# EAGLE design esp8266-hw7.1 (EAGLE 9.5.2)
ESP8266 HW
CNAME: Sensorboard; CREVISION: HW8.2; DESIGNER: Pär Sundbäck

## Sheet 1 of 2
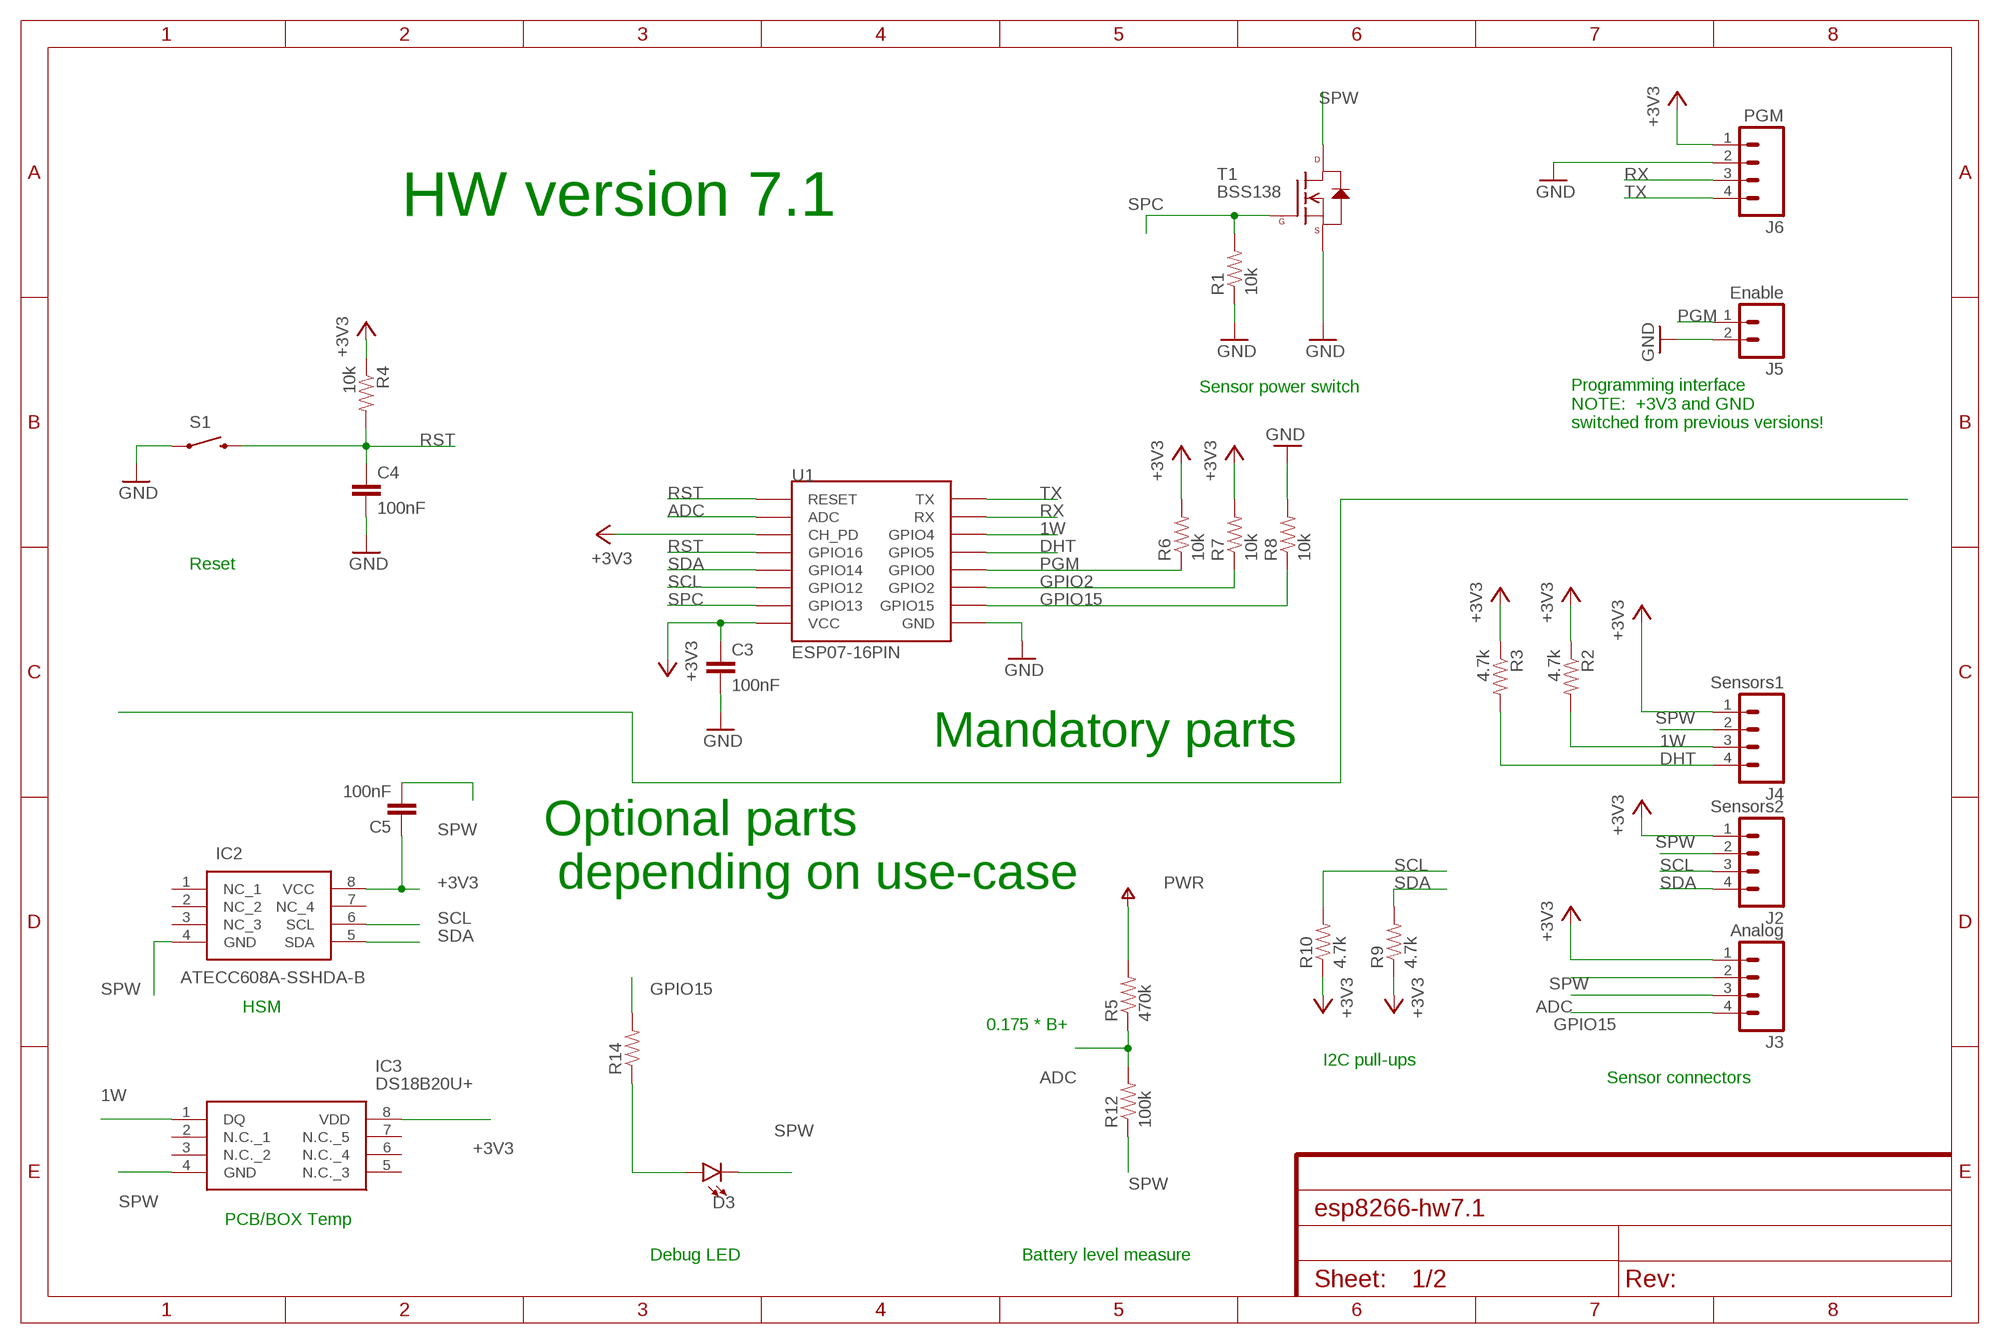
[diagram p0: schematic, sheet 1]

### Parts
C3  100nF  CAP0805  [0805]
C4  100nF  CAP0805  [0805]
C5  100nF  CAP0805  [0805]
D3  LED3MM  [LED_3MM]
IC2  ATECC608A-SSHDA-B  [SOIC127P600X175-8N]
IC3  DS18B20U+  [SOP65P490X110-8N]
J2  Sensors2  M04PTH  [1X04]
J3  Analog  M04PTH  [1X04]
J4  Sensors1  M04PTH  [1X04]
J5  Enable  M02PTH  [1X02]
J6  PGM  M04PTH  [1X04]
R1  10k  RESISTOR0805-RES  [0805]
R2  4.7k  RESISTOR0805-RES  [0805]
R3  4.7k  RESISTOR0805-RES  [0805]
R4  10k  RESISTOR0805-RES  [0805]
R5  470k  RESISTOR0805-RES  [0805]
R6  10k  RESISTOR0805-RES  [0805]
R7  10k  RESISTOR0805-RES  [0805]
R8  10k  RESISTOR0805-RES  [0805]
R9  4.7k  RESISTOR0805-RES  [0805]
R10  4.7k  RESISTOR0805-RES  [0805]
R12  100k  RESISTOR0805-RES  [0805]
R14  470  RESISTOR0805-RES  [0805]
S1  RESET  SWITCH-MOMENTARY-2SMD-1101NE  [TACTILE-SWITCH-1101NE]
T1  BSS138  N-CHANNEL-MOSFET-BSS138  [SOT23-3]
U1  ESP07-16PIN  [ESP07-16PIN]

### Nets
1W: IC3.1(DQ) J4.3 R2.2 U1.GPIO4
+3V3: C3.1 C5.1 IC2.8(VCC) IC3.8(VDD) J2.1 J3.1 J4.1 J6.1 R2.1 R3.1 R4.1 R6.2 R7.2 R9.1 R10.1 U1.CH_PD U1.VCC ; also sheet 2
ADC: J3.3 R5.1 R12.2 U1.ADC
DHT: J4.4 R3.2 U1.GPIO5
GND: C3.2 C4.2 J5.2 J6.2 R1.1 R8.2 S1.1 T1.2(S) U1.GND ; also sheet 2
GPIO2: R7.1 U1.GPIO2
GPIO15: J3.4 R8.1 R14.2 U1.GPIO15
N$8: D3.A R14.1
PGM: J5.1 R6.1 U1.GPIO0
PWR: R5.2 ; supply symbol labelled V+ ; also sheet 2
RST: C4.1 R4.2 S1.2 U1.GPIO16 U1.REST(RESET)
RX: J6.3 U1.RX
SCL: IC2.6(SCL) J2.3 R10.2 U1.GPIO12
SDA: IC2.5(SDA) J2.4 R9.2 U1.GPIO14
SPC: R1.2 T1.1(G) U1.GPIO13
SPW: C5.2 D3.K(C) IC2.4(GND) IC3.4(GND) J2.2 J3.2 J4.2 R12.1 T1.3(D)
TX: J6.4 U1.TX
Unconnected: IC2.1(NC_1) IC2.2(NC_2) IC2.3(NC_3) IC2.7(NC_4) IC3.2(N.C._1) IC3.3(N.C._2) IC3.5(N.C._3) IC3.6(N.C._4) IC3.7(N.C._5)

### Notes on the sheet
- HW version 7.1
- Sensor power switch
- Programming interface
  NOTE:  +3V3 and GND 
  switched from previous versions!
- Reset
- Mandatory parts
- Optional parts
   depending on use-case
- HSM
- 0.175 * B+
- I2C pull-ups
- Sensor connectors
- PCB/BOX Temp
- Debug LED | Battery level measure

## Sheet 2 of 2
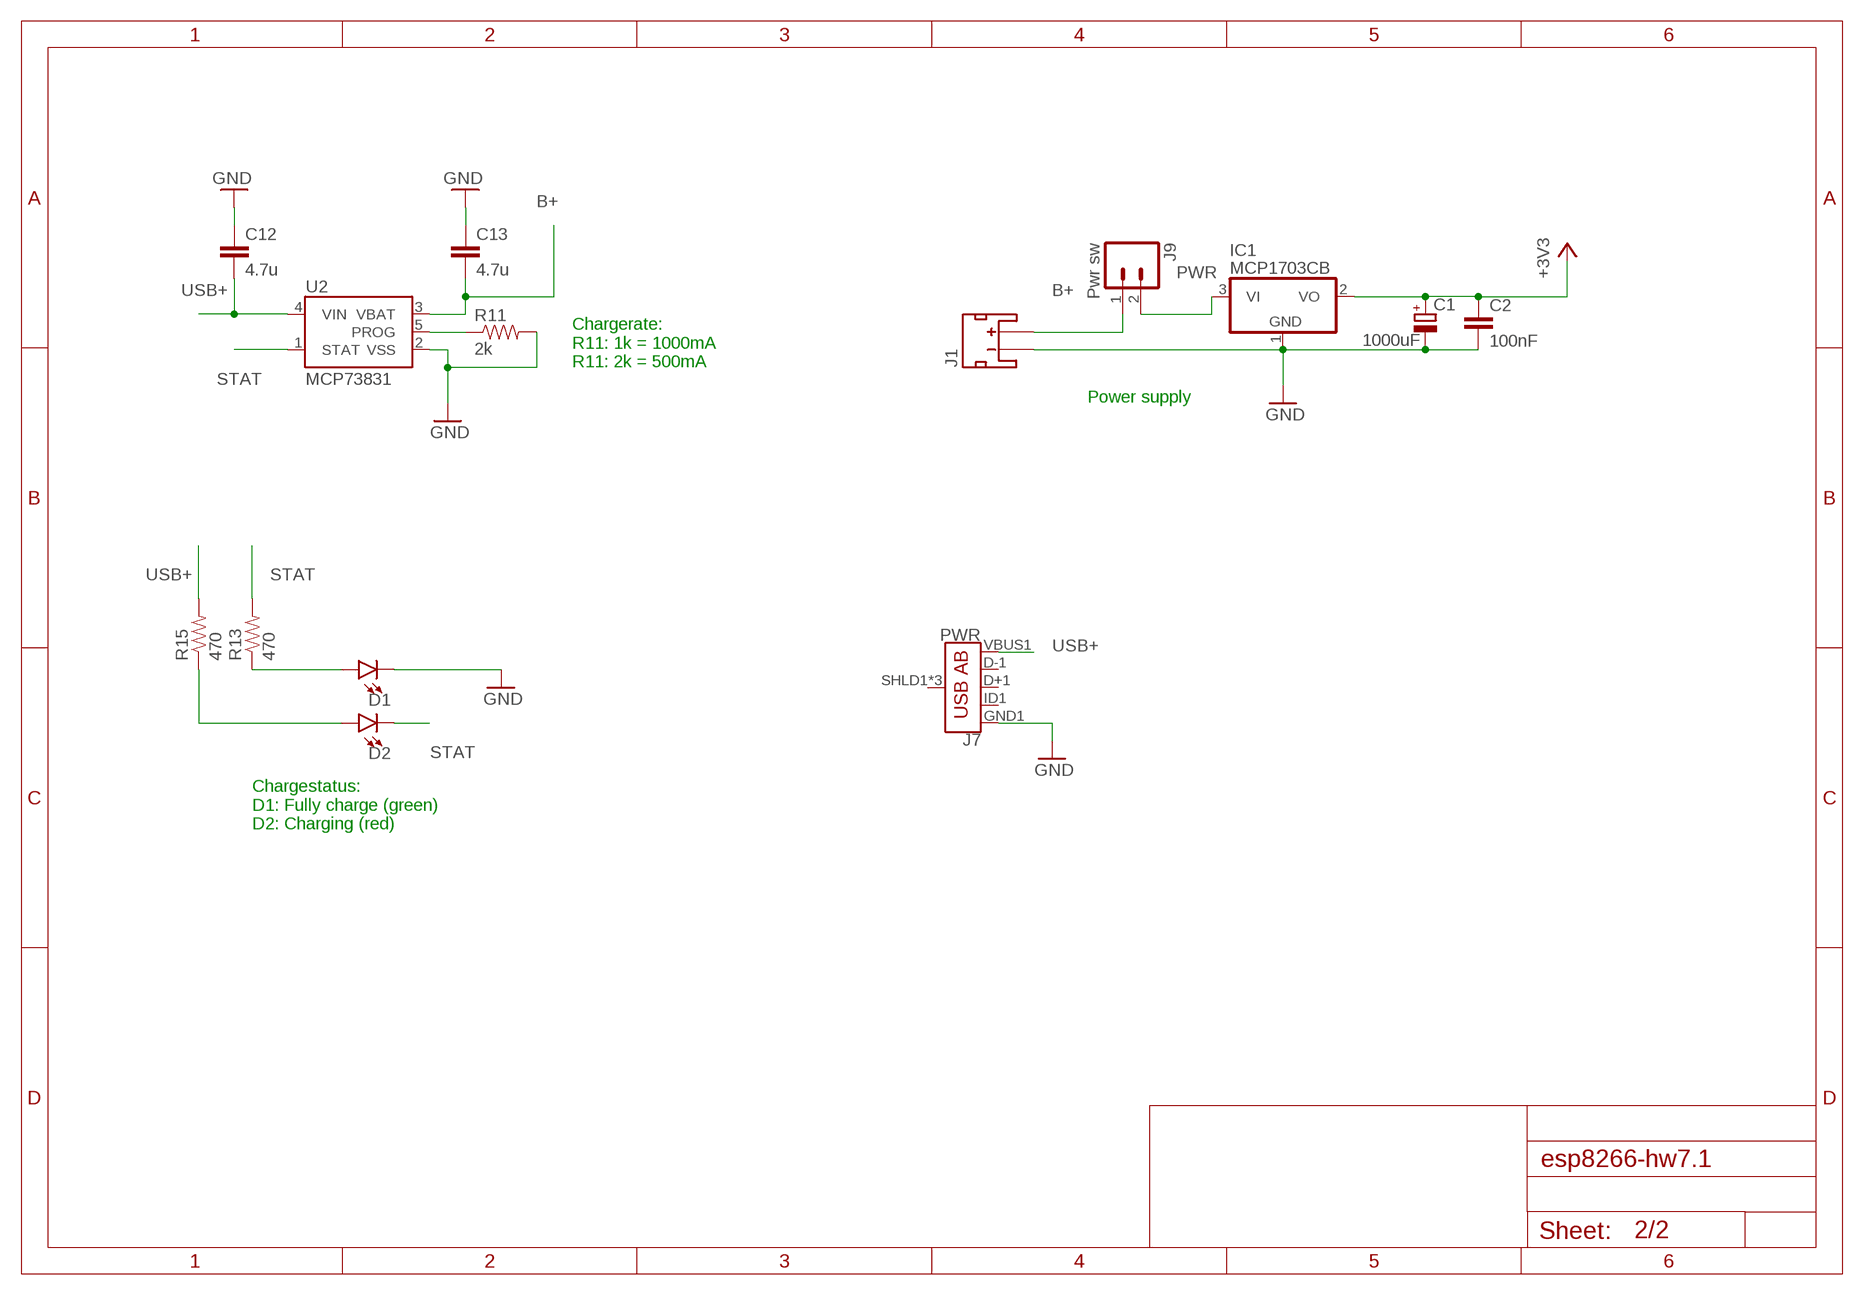
[diagram p1: schematic, sheet 2]

### Parts
C1  1000uF  CPOL-EUE3.5-8  [E3,5-8]
C2  100nF  CAP0805  [0805]
C12  4.7u  CAP0805  [0805]
C13  4.7u  CAP0805  [0805]
D1  LED3MM  [LED_3MM]
D2  LED3MM  [LED_3MM]
IC1  MCP1703CB  [SOT23]
J1  J1  JST_2MM_MALE  [JST-2-SMD]
J7  PWR  USB_AB_SMT  [USB-AB-MICRO-SMD]
J9  Pwr sw  M02PTH  [1X02]
R11  2k  RESISTOR0805-RES  [0805]
R13  470  RESISTOR0805-RES  [0805]
R15  470  RESISTOR0805-RES  [0805]
U2  MCP73831  [SOT23-5]

### Nets
+3V3: C1.+ C2.1 IC1.2(VO) ; also sheet 1
B+: C13.2 J1.2(+) J9.1 U2.3(VBAT)
GND: C1.- C2.2 C12.1 C13.1 D1.K(C) IC1.1(GND) J1.1(-) J7.GND1(GND) R11.2 U2.2(VSS) ; also sheet 1
N$2: D1.A R13.1
N$3: D2.A R15.1
N$10: R11.1 U2.5(PROG)
PWR: IC1.3(VI) J9.2 ; also sheet 1
STAT: D2.K(C) R13.2 U2.1(STAT)
USB+: C12.2 J7.VBUS1(VBUS) R15.2 U2.4(VIN)
Unconnected: J1.NC1(PAD1) J1.NC2(PAD2) J7.D+1(D+) J7.D-1(D-) J7.ID1(USBID) J7.SHLD1(SHIELD) J7.SHLD2(SHIELD) J7.SHLD3(SHIELD)

### Notes on the sheet
- Chargerate:
  R11: 1k = 1000mA
  R11: 2k = 500mA
- Power supply
- Chargestatus:
  D1: Fully charge (green)
  D2: Charging (red)

## Library data of the parts
C1 = rcl:CPOL-EU: POLARIZED CAPACITOR, European symbol; SPICEPREFIX: C
C2-C5 C12 C13 = SparkFun-Passives:CAP: Capacitor Standard 0603 ceramic capacitor, and 0.1" leaded capacitor.
D1-D3 = SparkFun-LED:LED: LED (Generic) Standard schematic elements and footprints for 5mm, 3mm, 1206, and 0603 sized LEDs. Generic LEDs with no color specified.; PROD_ID: DIO-08794
IC1 = linear:MCP1703: 250 mA, 16V, Low Quiescent Current LDO Regulator Source: http://ww1.microchip.com/downloads/en/DeviceDoc/22049b.pdf
IC2 = SamacSys_Parts:ATECC608A-SSHDA-B: Cryptoathentication ECC608A SOIC Source: Datasheet <https://componentsearchengine.com/Datasheets/1/ATECC608A-SSHDA-B.pdf>; DESCRIPTION: Cryptoathentication ECC608A SOIC; HEIGHT: 1.75mm; MANUFACTURER_NAME: Microchip; MANUFACTURER_PART_NUMBER: ATECC608A-SSHDA-B; MOUSER_PART_NUMBER: 556-ATECC608ASSHDAB; MOUSER_PRICE-STOCK: https://www.mouser.com/Search/Refine.aspx?Keyword=556-ATECC608ASSHDAB
IC3 = SamacSys_Parts:DS18B20U+: Board Mount Temperature Sensors Prgmble Resolution 1-Wire Parasite Pwr Source: Datasheet <https://componentsearchengine.com/Datasheets/1/DS18B20U .pdf>; DESCRIPTION: Board Mount Temperature Sensors Prgmble Resolution 1-Wire Parasite Pwr; HEIGHT: 1.1mm; MANUFACTURER_NAME: Maxim Integrated; MANUFACTURER_PART_NUMBER: DS18B20U+; MOUSER_PART_NUMBER: 700-DS18B20U; MOUSER_PRICE-STOCK: https://www.mouser.com/Search/Refine.aspx?Keyword=700-DS18B20U
J1 = SparkFun-Connectors:JST_2MM_MALE: Mates to single-cell LiPo batteries. CONN-11443 Now with smashable polarity marks!; BTM_NEG: -; BTM_POS: +; PROD_ID: CONN-11443; TOP_NEG: -; TOP_POS: +
J2-J4 J6 = SparkFun-Connectors:M04: Header 4 Standard 4-pin 0.1" header. Use with straight break away headers (SKU : PRT-00116), right angle break away headers (PRT-00553), swiss pins (PRT-00743), machine pins (PRT-00117), and female headers (PRT-00115). Molex polarized connector foot print use with SKU : PRT-08231 with associated crimp pins and housings. 1MM SMD Version SKU: PRT-10208; PROD_ID: CONN-09696
J5 J9 = SparkFun-Connectors:M02: Standard 2-pin 0.1" header. Use with - straight break away headers ( PRT-00116) - right angle break away headers (PRT-00553) - swiss pins (PRT-00743) - machine pins (PRT-00117) - female headers (PRT-00115) Molex polarized connector foot print use with: PRT-08233 with associated crimp pins and housings. 2.54_SCREWTERM for use with PRT-10571. 3.5mm Screw Terminal footprints for PRT-08084 5mm Screw Terminal footprints for use with PRT-08432
J7 = SparkFun-Connectors:USB_AB: USB Type AB Micro Connector OTG-compatible. 5 pins, 3 shield pins SparkFun Products: IOIO-OTG <https://www.sparkfun.com/products/13613> SparkFun SAMD21 Mini Breakout <https://www.sparkfun.com/products/13664>; PROD_ID: CONN-11794
R1-R15 = SparkFun-Resistors:RESISTOR: Resistor Basic schematic elements and footprints for 0603, 1206, and PTH resistors.
S1 = SparkFun-Electromechanical:SWITCH-MOMENTARY-2: Various NO switches- pushbuttons, reed, etc; PROD_ID: SWCH-00815
T1 = GeekAmmo:N-CHANNEL-MOSFET: N-Channel MOSFET Mode Field Effect Transistor; DATASHEET: http://www.fairchildsemi.com/ds/BS/BSS138.pdf; DIGIKEY: BSS138TR-ND; ELEMENT14: 2323154; URL: http://au.element14.com/fairchild-semiconductor/bss138/mosfet-n-ch-50v-220ma-sot-23/dp/2323154
U1 = esp8266modules:ESP07-16PIN: ESP8266 Wifi module 07 - 16 pins; DIMENSIONS: 22.0 x 16.0 mm; PINS: 16; PITCH: 0.078" / 2 mm
U2 = SparkFun-IC-Power:MCP73831: MCP73831T Li-Ion, Li-Pol Controller Miniature single cell, fully integrated Li-Ion, Li-polymer charge management controller Datasheet <http://ww1.microchip.com/downloads/en/DeviceDoc/20001984g.pdf> SparkFun Products: SparkFun ESP32 Thing <https://www.sparkfun.com/products/13907> SparkFun 9DoF Razor IMU M0 <https://www.sparkfun.com/products/14001>; PROD_ID: IC-09995

## Board
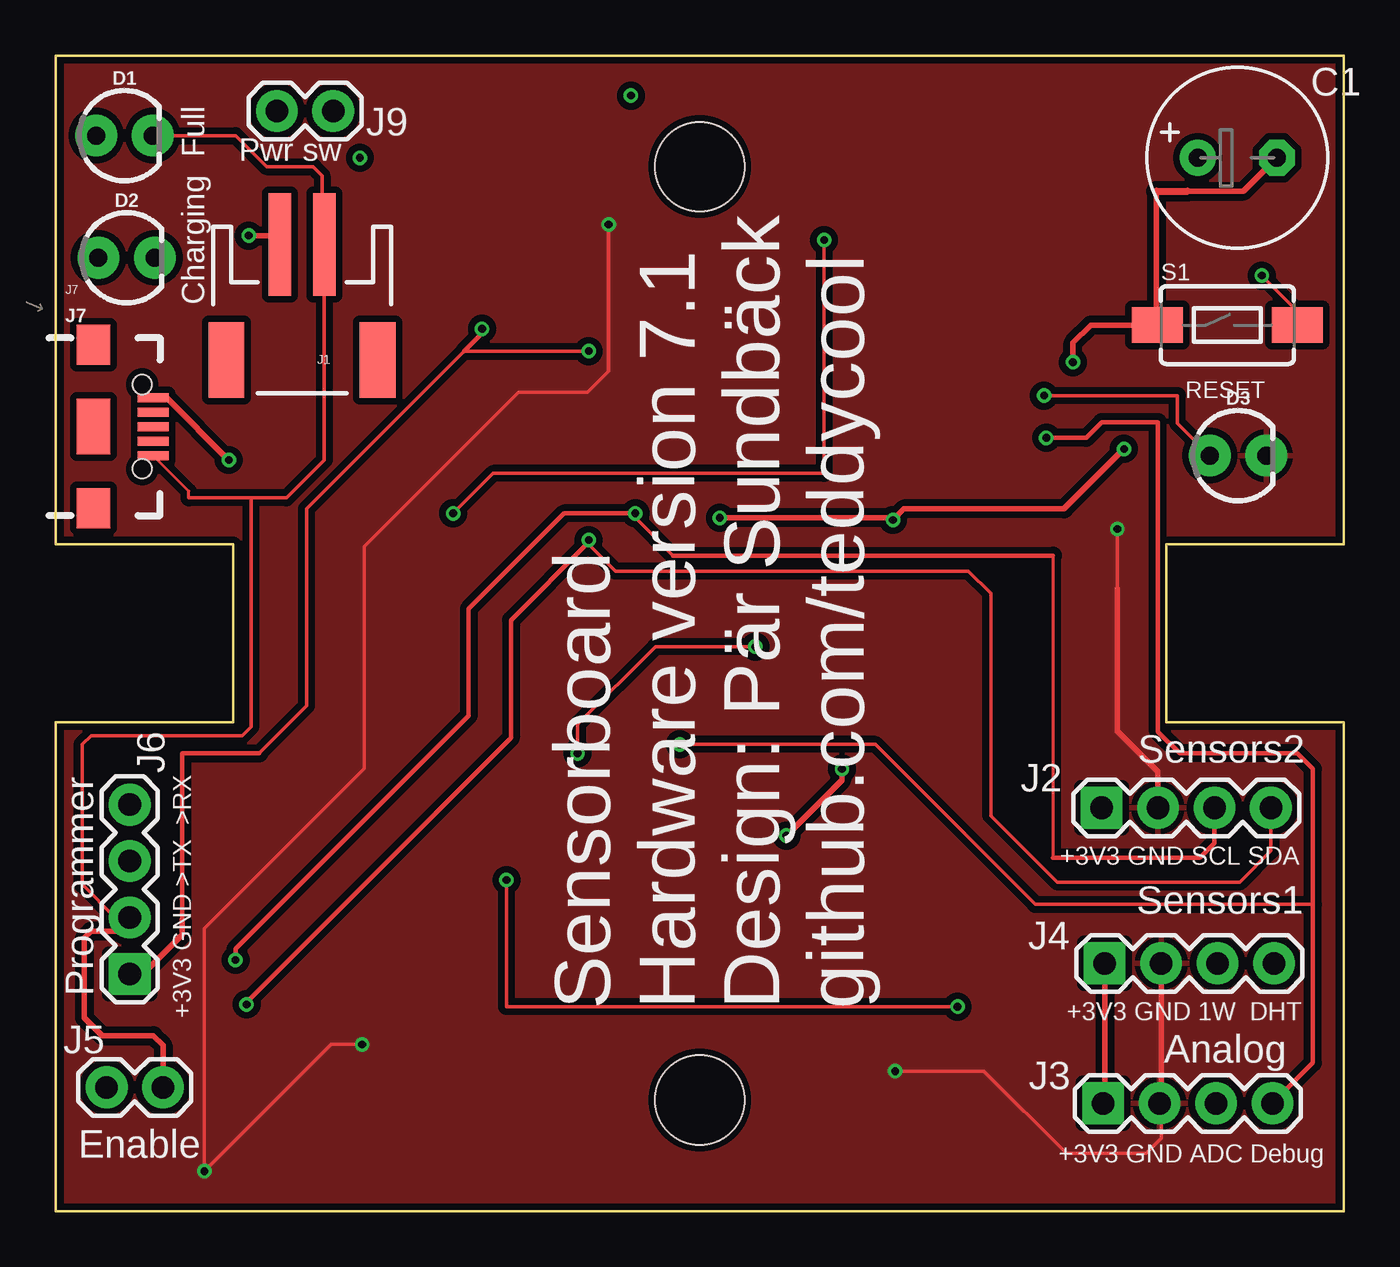
[diagram p2: board, top side]
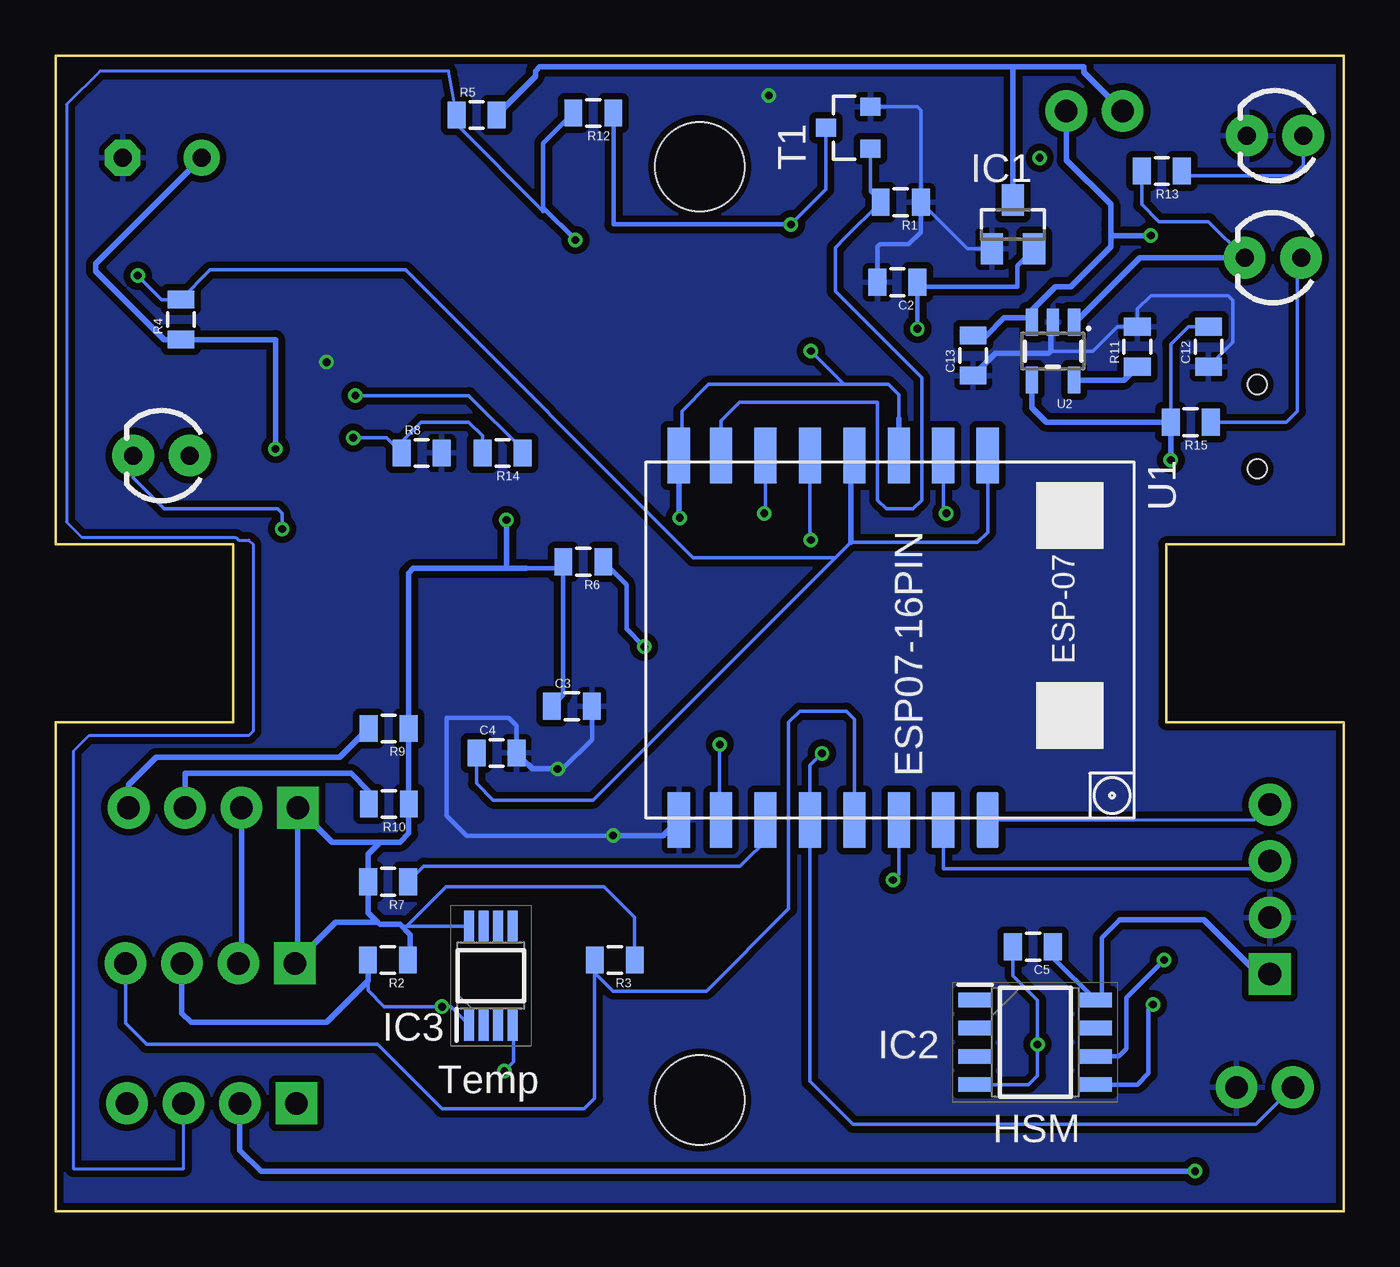
[diagram p3: board, bottom side, seen from below]

Size 58 x 52 mm. Coordinates in mm from the lower left corner, seen from the top.
Outline: 0,0 58,0 58,22 50,22 50,30 58,30 58,52 0,52 0,30 8,30 8,22 0,22 0,0
Copper layers (1*16): Top 0.035mm / dielectric 1.5mm / Bottom 0.035mm
Design rules "aisler_2_layer": minimum track width 0.1mm, minimum drill 0.2mm, track to track 0.1mm, track to pad 0.1mm, pad to pad 0.1mm, via to via 0.1mm, smd to smd 0.1mm, copper to edge 0.2mm, drill to drill 0.21mm, minimum pad ring 0.25mm, minimum via ring 0.15mm, stop-mask expansion 0mil, vias tented up to drill 0mil, thermal gap 10mil
Holes 4 mm at 29,47 29,5

### Footprints (pad centres in the part's own frame; a part is rotated, then mirrored left to right if it is on the bottom)
E3,5-8 = drill 0.813 pad 1.6: + -1.778,0 | drill 0.813 pad 1.6 octagon: - 1.778,0
0805 = smd 0.8 x 1.2: 1 -0.9,0; 2 0.9,0
LED_3MM = drill 0.813 pad 1.88: A -1.27,0; K 1.27,0
SOT23 = smd 1 x 1.4: 1 -0.95,-1.1; 2 0.95,-1.1; 3 0,1.1
SOIC127P600X175-8N = smd 1.5 x 0.65: 1 -2.7,1.905; 2 -2.7,0.635; 3 -2.7,-0.635; 4 -2.7,-1.905; 5 2.7,-1.905; 6 2.7,-0.635; 7 2.7,0.635; 8 2.7,1.905
SOP65P490X110-8N = smd 1.425 x 0.45: 1 -2.212,0.975; 2 -2.212,0.325; 3 -2.212,-0.325; 4 -2.212,-0.975; 5 2.212,-0.975; 6 2.212,-0.325; 7 2.212,0.325; 8 2.212,0.975
JST-2-SMD = smd 1 x 4.6: 1 -1,-3.7; 2 1,-3.7 | smd 1.6 x 3.4: NC1 -3.4,1.5; NC2 3.4,1.5
1X04 = drill 1.016 pad 1.88 square: 1 0,0 | drill 1.016 pad 1.88: 2 2.54,0; 3 5.08,0; 4 7.62,0
1X02 = drill 1.016 pad 1.88: 1 0,0; 2 2.54,0
USB-AB-MICRO-SMD = smd 1.4 x 0.4: D+1 2.7,0; D-1 2.7,0.65; GND1 2.7,-1.3; ID1 2.7,-0.65; VBUS1 2.7,1.3 | smd 1.5 x 1.8: SHLD1 0,-3.68; SHLD2 0,3.68 | smd 1.5 x 2.5: SHLD3 0,0 | hole 0.85: 2.2,1.9; 2.2,-1.9
TACTILE-SWITCH-1101NE = smd 2.3 x 1.6: 1 -3.15,0; 2 3.15,0
SOT23-3 = smd 0.8 x 0.9: 1 -0.95,-1; 2 0.95,-1; 3 0,1
ESP07-16PIN = smd 2.5 x 1: ADC -8.2,3.8; CH_PD -8.2,1.8; GND 8.2,-8.105; GPIO0 8.2,-2.2; GPIO2 8.2,-4.2; GPIO4 8.2,1.8; GPIO5 8.2,-0.2; GPIO12 -8.2,-4.2; GPIO13 -8.2,-6.2; GPIO14 -8.2,-2.2; GPIO15 8.2,-6.2; GPIO16 -8.2,-0.2; REST -8.2,5.8; RX 8.2,3.8; TX 8.2,5.8; VCC -8.2,-8.105
SOT23-5 = smd 0.55 x 1.2: 1 -0.95,-1.3; 2 0,-1.3; 3 0.95,-1.3; 4 0.95,1.3; 5 -0.95,1.3

### Placement (x,y rotation side)
C1  53.2,47.4 0 top
C2  20.1,41.8 180 bottom
C3  34.76,22.72 0 bottom
C4  38.15,20.62 0 bottom
C5  14,11.9 180 bottom
C12  6.1,38.9 90 bottom
C13  16.7,38.5 90 bottom
D1  3.1,48.4 0 top
D2  3.2,42.9 0 top
D3  53.23,34 0 top
IC1  14.9,44.4 0 bottom
IC2  13.9,7.6 0 bottom
IC3  38.4,10.6 90 bottom
J1  11.1,39.8 180 top
J2  47.09,18.15 0 top
J3  47.16,4.85 0 top
J4  47.23,11.15 0 top
J5  2.3,5.57 0 top
J6  3.34,10.67 90 top
J7  1.7,35.3 0 top
J9  12.5,49.5 180 top
R1  19.95,45.4 180 bottom
R2  43.04,11.3 180 bottom
R3  32.83,11.3 180 bottom
R4  52.36,40.12 90 bottom
R5  39.05,49.32 0 bottom
R6  34.24,29.22 180 bottom
R7  43.03,14.82 180 bottom
R8  41.52,34.12 0 bottom
R9  43.01,21.72 180 bottom
R10  43,18.32 180 bottom
R11  9.3,38.9 90 bottom
R12  33.79,49.42 180 bottom
R13  8.2,46.8 180 bottom
R14  37.88,34.12 180 bottom
R15  6.9,35.5 180 bottom
S1  52.75,39.87 0 top
T1  22.32,48.75 90 bottom
U1  21.84,25.8 270 bottom
U2  13.1,38.7 180 bottom

### Tracks (layer width: path | path; a pad name or v marks a point on that pad's centre or on a via)
1W  (via drill 0.35)
  Top 0.152: v40.6,9.2 20.3,9.2 v20.3,14.9
  Bottom 0.152: R2.2 43.94,9.94 43.2,9.2 v40.6,9.2 40.19,9.2 IC3.1 | U1.GPIO4 20.04,15.16 v20.3,14.9
  Bottom 0.254: J4.3 52.31,8.91 51.9,8.5 45.8,8.5 43.94,10.36 R2.2
+3V3  (via drill 0.35)
  Top 0.152: 9.17,20.6 11.3,22.73 11.3,31.6 18.4,38.7 v24,38.7
  Top 0.203: 9.17,20.6 5.7,20.6 5.7,13.11 | 18.4,38.7 19.2,39.5 v19.2,39.7
  Top 0.254: J4.1 47.23,4.92 J3.1 | v48.1,34.3 45.4,31.6 38.2,31.6 v37.7,31.1 37.6,31.2 v29.9,31.2 | 5.7,13.11 5.7,12.43 3.94,10.67 J6.1
  Bottom 0.152: U1.CH_PD 20.04,36.74 20.5,37.2 22.5,37.2 | 22.5,37.2 28.6,37.2 29.8,36 29.8,34.15 U1.VCC | IC3.8 42.2,12.81 | 42.2,12.81 42.41,12.81 42.5,12.9 | R3.1 31.93,13.23 33.3,14.6 40.41,14.6 42.2,12.81 | v24,38.7 22.5,37.2
  Bottom 0.2: C3.1 35.16,23.22 35.16,29 | C5.1 13.1,11.4 IC2.8 10.9,9.8 10.9,12.3 10.09,13.11 | 35.16,29 35.16,29.34 35.14,29.32 R6.2 35.15,29.05 35.28,28.92 | 37,28.92 35.24,28.92 35.16,29
  Bottom 0.203: IC1.2 14.7,42.55 14.7,41.6 19,41.6 C2.1 v19.2,39.7
  Bottom 0.254: 37.7,28.92 41.9,28.92 42.11,28.71 R9.1 R10.1 42.1,17 42.5,16.6 43.4,16.6 | 37.7,28.92 37,28.92 36.82,28.92 | R2.1 42.03,11.41 42.03,12.43 42.5,12.9 43.4,12.9 43.5,13 | U1.CH_PD 20.04,35.66 | 43.4,16.6 43.93,16.07 R7.2 43.93,13.43 43.5,13 | 43.4,16.6 45.54,16.6 J2.1 47.09,11.29 J4.1 45.38,13 43.5,13 | v48.1,34.3 48.1,39.22 R4.1 53.12,39.22 56.2,42.3 56.2,42.62 C1.+ | U1.VCC 29.95,31.25 v29.9,31.2 | v37.7,31.1 37.7,28.92 | 10.09,13.11 6.31,13.11 3.87,10.67 J6.1
ADC  (via drill 0.35)
  Top 0.152: v34.6,43.7 34.6,33.2 19.7,33.2 v17.9,31.4
  Bottom 0.127: R5.1 40.3,51.3 56,51.3 57.5,49.8 57.5,31 56.81,30.31 49.87,30.31 49.76,30.2 49.3,30.2 49.1,30 49.1,21.6 49.3,21.4 56.5,21.4 57.2,20.7 57.2,1.9 52.24,1.9 J3.3
  Bottom 0.152: R5.1 39.95,48.9 36.05,45 | 36.05,46 36.05,45.35 | U1.ADC 18.04,31.54 v17.9,31.4
  Bottom 0.2: R12.2 36.05,48.06 36.05,46 36.05,45 | 36.05,45.35 36.05,45.15 v34.6,43.7 34.5,43.6
B+  (via drill 0.35)
  Top 0.254: v8.7,43.9 9.7,43.9 J1.2
  Bottom 0.254: J9.1 12.5,47.3 10.5,45.3 10.5,44.4 10.5,44 | 10.5,44 10.5,43.4 12.3,41.6 13,41.6 14.05,40.55 14.05,40.1 | 14.05,40.1 U2.3 | C13.2 16.1,39.4 15.3,40.2 14.15,40.2 14.05,40.1 | 10.5,44 10.4,43.9 v8.7,43.9
DHT
  Bottom 0.152: U1.GPIO5 22.04,22.14 22.4,22.5 24.5,22.5 25,22 25,13.6 28.7,9.9 32.9,9.9 33.73,10.73 | 33.73,10.73 R3.2 | J4.4 54.85,8.45 53.9,7.5 43.5,7.5 40.6,4.6 34.2,4.6 33.73,5.07 33.73,10.73
GND  (via drill 0.35)
  Top 0.127: J7.GND1 6,32.4 6,32.1
  Top 0.152: D1.K 8.1,48.4 9.5,47 11.6,47 12,46.6 12,44.1 | J1.1 12.1,33.8 10.4,32.1 8.8,32.1 | 8.8,32.1 6,32.1 | J6.2 2.69,13.21 1.2,14.7 1.2,21 1.6,21.4 8.4,21.4 8.8,21.8 8.8,32.1
  Top 0.254: 49.56,45.9 49.56,39.91 S1.1 46.6,39.87 45.8,39.07 v45.8,38.2 | v35.4,19.9 35.4,19.4 v32.9,16.9 | J6.2 2.73,12.6 1.6,12.6 1.3,12.3 1.3,8.7 2.1,7.9 4.4,7.9 4.84,7.46 J5.2 | 50.96,45.9 53.48,45.9 C1.-
  Top 0.305: 49.56,45.9 50.96,45.9
  Bottom 0.152: T1.2 19.2,49.7 19.05,49.55 R1.1 16.95,43.3 IC1.1 | C12.1 5,39.1 5,41 5.2,41.2 8.7,41.2 9.3,40.6 R11.2 10.2,39.8 11.3,38.7 13.2,38.7
  Bottom 0.2: v35.4,19.9 35.18,19.9 33.86,21.22 C3.2 | v32.9,16.9 39.5,16.9 40.4,17.8 40.4,22.2 37.6,22.2 37.25,21.85 37.25,20.64 | 36.72,20.09 C4.2 37.25,20.64 | C4.2 37.25,20.64
  Bottom 0.203: R1.1 19.05,44.05 19.6,43.5 20.9,43.5 21,43.4 C2.2
  Bottom 0.254: C4.2 | 36.72,20.09 36.53,19.9 v35.4,19.9 | v32.9,16.9 30.64,16.9 U1.GND | v45.8,38.2 45.87,38.13 | U2.2 13.2,39.9 13.2,38.7 13.3,38.6 15.7,38.6 C13.1
  other vias: 25.9,50.2
  pour Bottom (isolate 0.305): -0.1,0 58.1,0 58.1,0.1 58.1,52.1 58,52.1 -0.1,52.1 -0.1,51.9
GPIO2
  Bottom 0.152: R7.1 41.43,15.52 27.18,15.52 25.8,16.9 25.8,17.36 U1.GPIO2
GPIO15  (via drill 0.35)
  Top 0.152: v28.1,21 36.9,21 44.1,13.8 56.6,13.8
  Top 0.203: J3.4 56.6,6.67 56.6,13.8 56.6,19.9 55.9,20.6 50.6,20.6 49.63,21.57 49.63,35.5 47.1,35.5 46.4,34.8 v44.6,34.8
  Bottom 0.152: v28.1,21 28.1,17.66 U1.GPIO15 | v44.6,34.8 43.1,34.8 R8.1 42.42,34.62 41.54,35.5 39.4,35.5 38.78,34.88 R14.2
N$2
  Bottom 0.152: R13.1 7.1,46.6 2.3,46.6 1.83,47.07 D1.A
N$3
  Bottom 0.152: R15.1 2.6,35.5 2.1,36 2.1,42.71 1.93,42.88 D2.A
N$5  (via drill 0.35)
  other vias: 13.7,47.4
N$8  (via drill 0.35)
  Top 0.152: D3.A 50.5,35.46 50.5,36.7 v44.5,36.7
  Bottom 0.152: R14.1 36.98,34.28 39.4,36.7 v44.5,36.7
N$10
  Bottom 0.254: U2.5 9.9,37.4 R11.1
PGM  (via drill 0.35)
  Top 0.152: v31.5,25.4 27,25.4 23.5,21.9 v23.5,20.6
  Bottom 0.152: J5.1 3.97,3.9 22.1,3.9 24.04,5.84 U1.GPIO0 24.04,20.06 v23.5,20.6
  Bottom 0.2: R6.1 32.3,28.18 32.3,26.2 v31.5,25.4
PWR
  Bottom 0.254: J9.2 11.7,51.24 11.7,51.5 14.7,51.5 14.8,51.5 | 14.8,51.5 14.9,51.4 IC1.3 | R5.2 36.4,51.07 36.4,51.3 36.2,51.5 14.8,51.5
RST  (via drill 0.35)
  Top 0.152: S1.2 55.9,40.5 v54.3,42.1
  Bottom 0.152: v54.3,42.1 53.22,41.02 R4.2 51.03,42.35 42.25,42.35 29.3,29.4 22.9,29.4 | C4.1 39.05,19.25 38.3,18.5 33.8,18.5 22.9,29.4 | U1.REST 16.04,30.56 16.5,30.1 22.2,30.1 22.9,29.4
  Bottom 0.254: U1.GPIO16 22.2,33.84 22.2,30.1
RX
  Bottom 0.152: U1.RX 18.04,15.4 3.8,15.4 3.45,15.75 J6.3
SCL  (via drill 0.35)
  Top 0.127: 44.9,29.5 44.9,15.9
  Top 0.152: 27.8,29.5 26.1,31.2 v26.1,31.4
  Top 0.2: v26.1,31.4 22.9,31.4 18.6,27.1 18.6,22.3 8.1,11.8 v8.1,11.3
  Top 0.203: 27.8,29.5 44.9,29.5 | J2.3 52.17,16.55 51.52,15.9 44.9,15.9
  Bottom 0.152: U1.GPIO12 26.04,31.46 v26.1,31.4
  Bottom 0.2: v8.1,11.3 9.8,9.6 9.8,7.3 10.13,6.96 IC2.6
  Bottom 0.254: R10.2 43.9,18.9 44.7,19.7 52.17,19.7 J2.3
SDA  (via drill 0.35)
  Top 0.152: J2.4 54.71,16.21 53.3,14.8 45.1,14.8 42.1,17.8 42.1,27.8 41.1,28.8 25.2,28.8 24,30 v24,30.2
  Top 0.2: v24,30.2 24,30.1 20.5,26.6 20.5,21.3 8.6,9.4 v8.6,9.3
  Bottom 0.152: U1.GPIO14 24.04,30.24 v24,30.2
  Bottom 0.2: v8.6,9.3 8.8,9.1 8.8,6.2 9.3,5.7 IC2.5
  Bottom 0.254: J2.4 54.71,19.19 53.48,20.42 45.21,20.42 R9.2
SPC
  Bottom 0.152: U1.GPIO13 28.04,35.56 27.2,36.4 21,36.4 21,32 20.6,31.6 19.4,31.6 19,32 19,37.5 22.9,41.4 22.9,43.35 22.48,43.77 R1.2 21.32,45.87 T1.1
SPW  (via drill 0.35)
  Top 0.152: v24.9,44.4 24.9,37.8 23.95,36.85 20.85,36.85 13.9,29.9 13.9,19.9 6.7,12.7 v6.7,1.8 12.4,7.5 v13.8,7.5 | v47.8,30.7 47.8,28 | v37.8,6.3 41.8,6.3 45.5,2.6 49.1,2.6 49.77,3.27 49.77,4.92
  Top 0.254: J4.2 49.77,4.92 J3.2 | 47.8,28 47.8,21.6 49.63,19.77 J2.2
  Bottom 0.127: v24.9,44.4 24.87,44.4
  Bottom 0.152: IC2.4 14.21,5.7 13.8,6.1 v13.8,7.5 13.8,9.5 14.9,10.6 C5.2 | D3.K 54.5,33 53.1,31.6 48,31.6 47.8,31.4 v47.8,30.7 | IC3.4 37.37,8.34 37.37,6.73 v37.8,6.3 | v24.9,44.4 23.32,45.98 T1.3
  Bottom 0.2: v24.9,44.4 32.89,44.4 R12.1
  Bottom 0.254: J2.2 49.63,11.29 J4.2 | J3.2 49.7,2.75 48.75,1.8 v6.7,1.8
  pour Top (isolate 0.305): 0,-0.1 58,-0.1 58,0.4 58,52.1 57.9,52.1 -0.1,52.1 -0.1,51.9 -0.1,-0.1
STAT
  Bottom 0.152: D2.K 6.1,44.53 8.33,44.53 9.1,45.3 R13.2
  Bottom 0.254: U2.1 12.1,40 9.2,42.9 D2.K
TX
  Bottom 0.127: U1.TX 4.03,17.6 J6.4
USB+  (via drill 0.35)
  Top 0.254: J7.VBUS1 5,36.6 v7.8,33.8
  Bottom 0.152: C12.2 7,39.8 7.8,39 R15.2
  Bottom 0.254: U2.4 14.05,36.15 13.4,35.5 R15.2 v7.8,33.8

### Text on the board
tNames: Charging Full | +3V3 GND SCL SDA | Programmer | +3V3 GND >TX >RX | Sensorboard / Hardware version 7.1 / Design: Pär Sundbäck / github.com/teddycool | +3V3 GND 1W DHT | +3V3 GND ADC Debug
bNames: Temp | HSM